# Altium project PRJ_Arduino_uno_r3_THT.PrjPcb
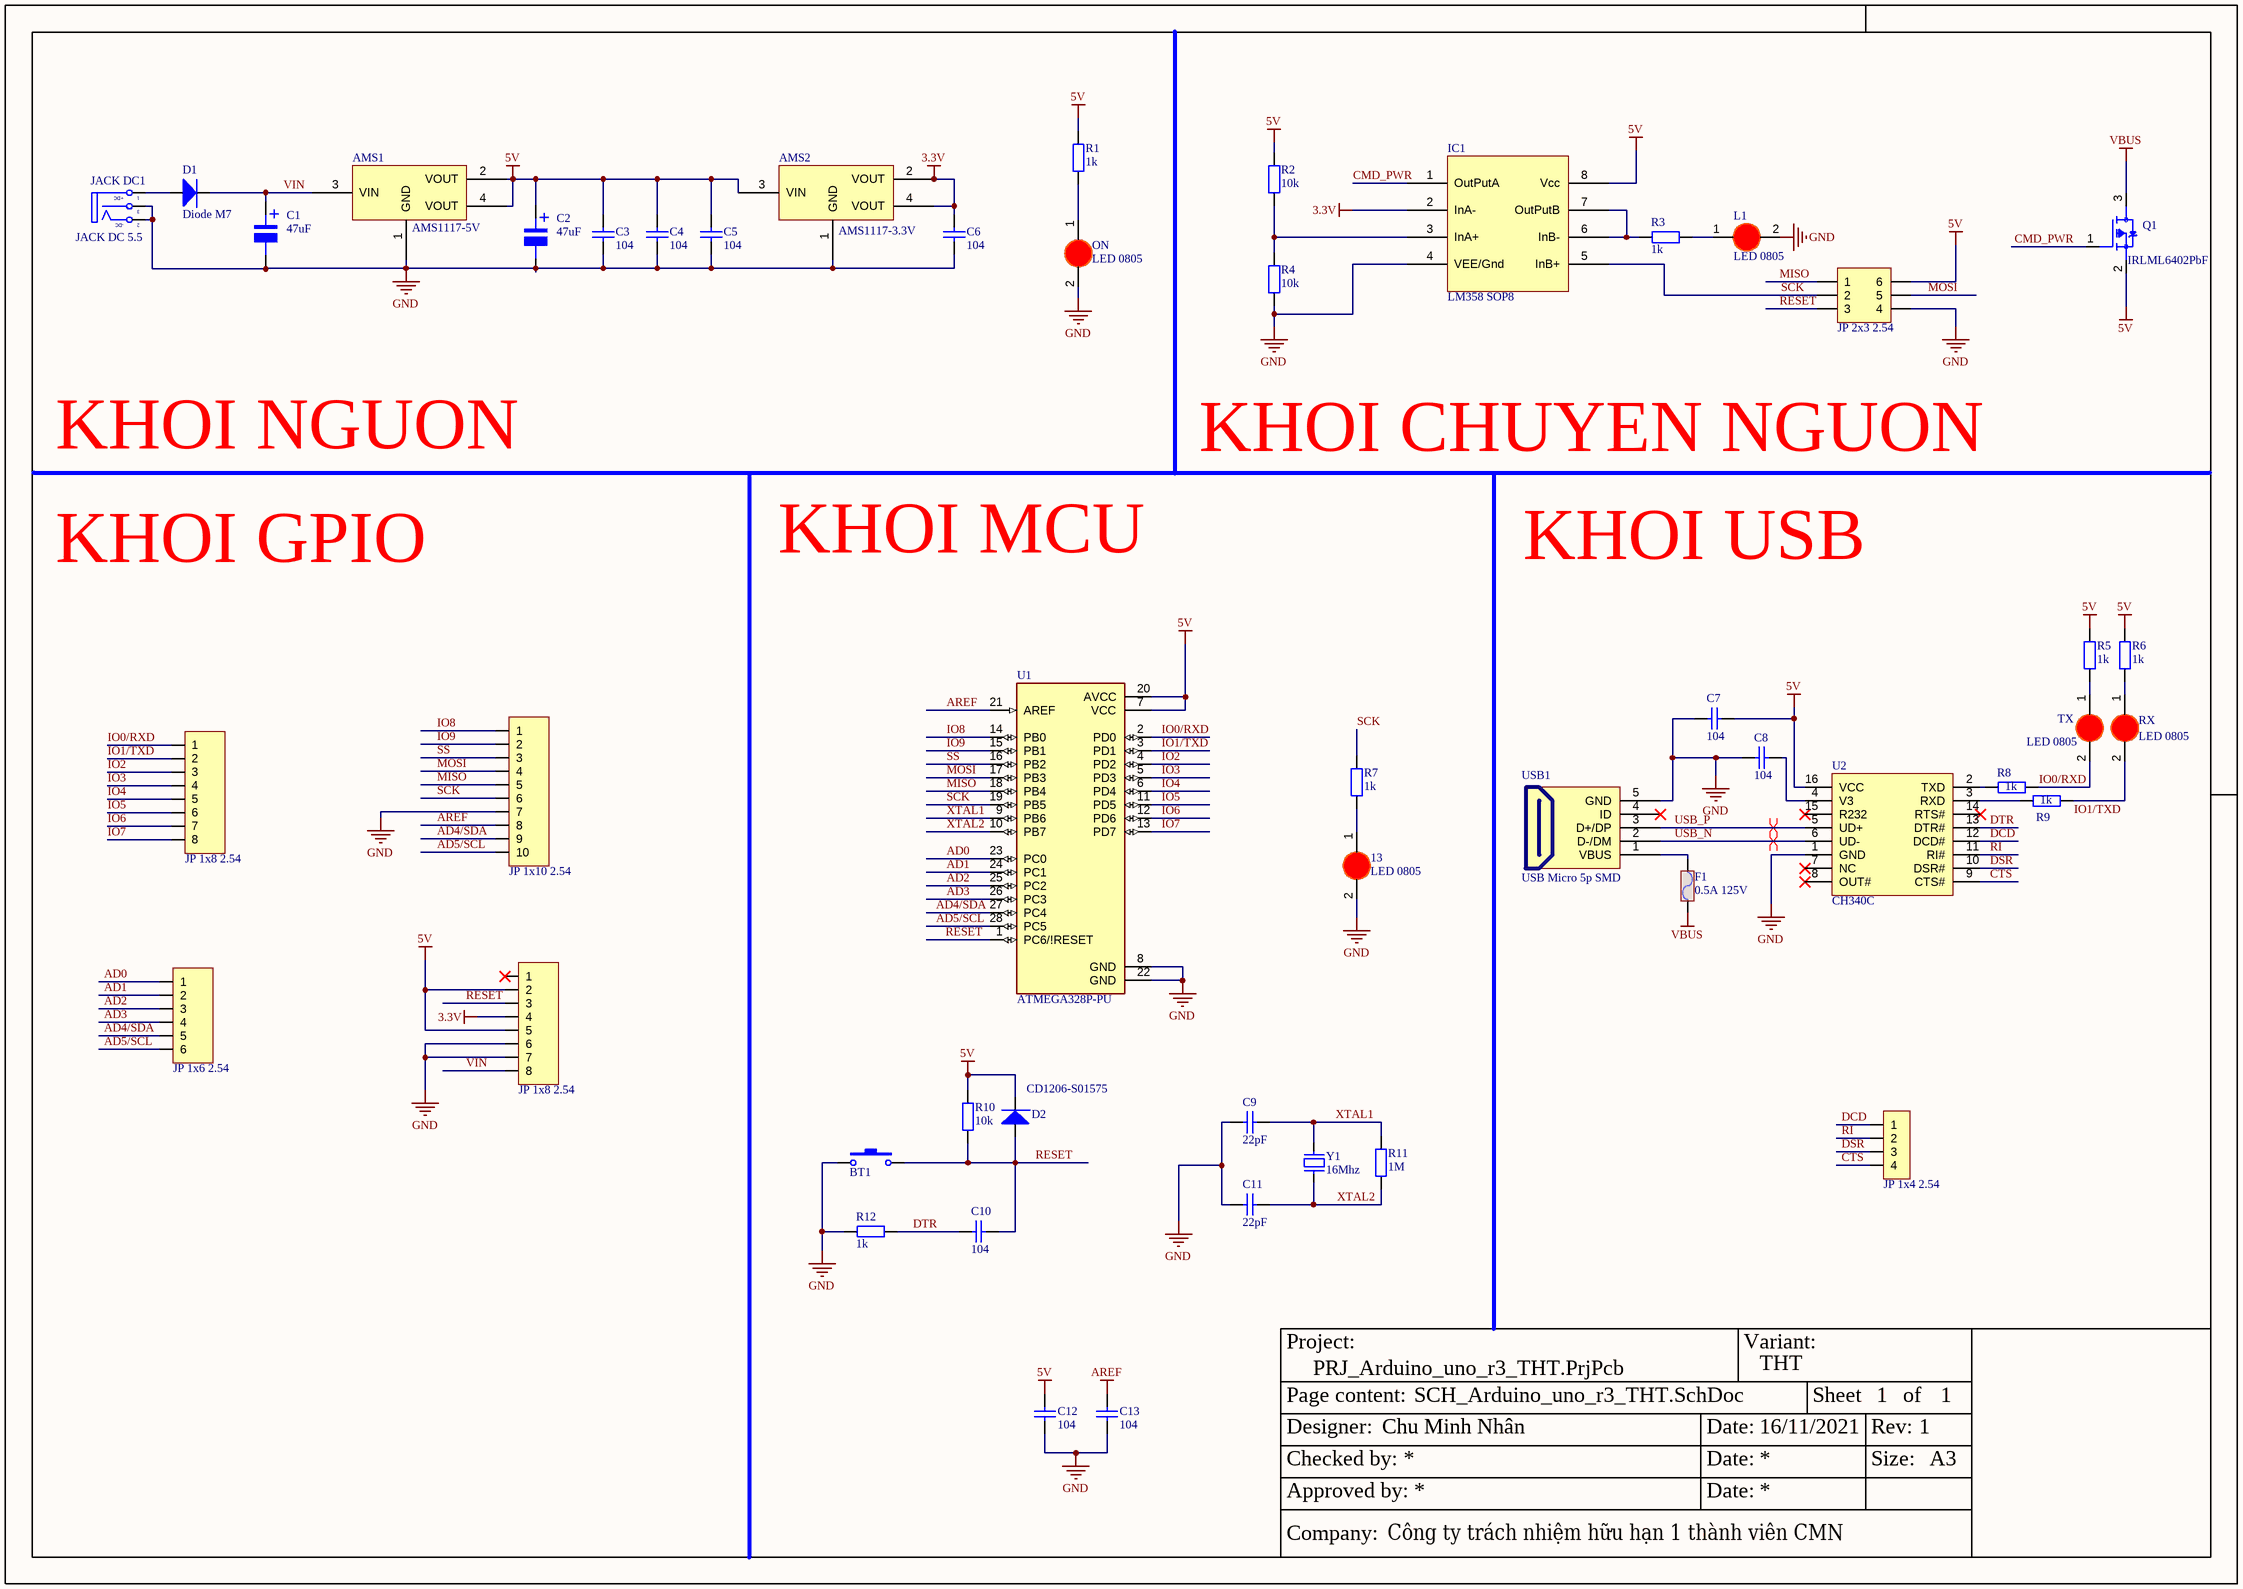
[diagram p0: SCH_Arduino_uno_r3_THT.SchDoc]
1 sheet, 49 parts. Net scope: global (net labels, ports and power ports of the same name join across sheets).
Board file: PCB_Arduino_uno_r3_THT.PcbDoc

## Sheet SCH_Arduino_uno_r3_THT.SchDoc
size 420 x 297 mm; Author: Chu Minh Nhân; CompanyName: Công ty trách nhiệm hữu hạn 1 thành viên CMN; Revision: 1; SheetNumber: 1; SheetTotal: 1; SheetSize: A3; Variant: THT; DateDesigned: 16/11/2021

### Parts
13  LED 0805  [LED-0805-Red]
AMS1  AMS1117-5V  [SOT223]
AMS2  AMS1117-3.3V  [SOT223]
BT1  Nut Nhan 2 Chan SMD 3x6x2.5  [Nut Nhan 2 Chan SMD 3x6x2.5]  (value not drawn)
C1  47uF  [tu nhom 6.3 (d)]
C2  47uF  [tu nhom 6.3 (d)]
C3  104  [tu 0805]
C4  104  [tu 0805]
C5  104  [tu 0805]
C6  104  [tu 0805]
C7  104  [tu 0805]
C8  104  [tu 0805]
C9  22pF  [tu 0805]
C10  104  [tu 0805]
C11  22pF  [tu 0805]
C12  104  [tu 0805]
C13  104  [tu 0805]
D1  Diode M7  [Diode M7]
D2  CD1206-S01575  [CD1206-S01575]
F1  0.5A 125V  [Cau Chi SMD1808]
IC1  LM358 SOP8  [SOP 8]
JACK_DC1  JACK DC 5.5  [JACK DC 5.5]
JP1  JP 2x3 2.54  [JP 2x3 DT - duplicate]
JP2  JP 1x10 2.54  [JP 1x10 CT]
JP3  JP 1x8 2.54  [JP 1x8 CT]
JP4  JP 1x8 2.54  [JP 1x8 CT]
JP5  JP 1x6 2.54  [JP 1x6 CT]
JP6  JP 1x4 2.54  [JP 1x4 DT - duplicate]
L1  LED 0805  [LED-0805-Red]
ON  LED 0805  [LED-0805-Red]
Q1  IRLML6402PbF  [SOT23_1]
R1  1k  [tro smd 0805]
R2  10k  [tro smd 0805]
R3  1k  [tro smd 0805]
R4  10k  [tro smd 0805]
R5  1k  [tro smd 0805]
R6  1k  [tro smd 0805]
R7  1k  [tro smd 0805]
R8  1k  [tro smd 0805]
R9  1k  [tro smd 0805]
R10  10k  [tro smd 0805]
R11  1M  [tro smd 0805]
R12  1k  [tro smd 0805]
RX  LED 0805  [LED-0805-Red]
TX  LED 0805  [LED-0805-Red]
U1  ATMEGA328P-PU  [28 SPDIP]
U2  CH340C  [SOIC16_50_284_25X90_SMT]
USB1  USB Micro 5p SMD  [USB Micro 5p SMD]
Y1  16Mhz  [Thach Anh 2 chan SMD]

### Nets
3.3V: AMS2.2(VOUT) AMS2.4(VOUT) C6.1 IC1.2(InA-) JP4.4
5V: AMS1.2(VOUT) AMS1.4(VOUT) AMS2.3(VIN) C2.1 C3.1 C4.1 C5.1 C7.2 C12.2 D2.Cathode IC1.8(Vcc) JP1.6 JP4.2 JP4.5 Q1.2(S) R1.2 R2.2 R5.1 R6.1 R10.2 U1.7(VCC) U1.20(AVCC) U2.16(VCC)
AREF: C13.2 JP2.8 U1.21(AREF)
GND: 13.2(K) AMS1.1(GND) AMS2.1(GND) BT1.1 C1.2 C2.2 C3.2 C4.2 C5.2 C6.2 C7.1 C8.1 C9.2 C11.2 C12.1 C13.1 IC1.4(VEE/Gnd) JACK_DC1.2(TN) JACK_DC1.3(S) JP1.4 JP2.7 JP4.6 JP4.7 L1.2(K) ON.2(K) R4.1 R12.1 U1.8(GND) U1.22(GND) U2.1(GND) USB1.5(GND)
VBUS: F1.1 Q1.3(D)
AD0: JP5.1 U1.23(PC0)
AD1: JP5.2 U1.24(PC1)
AD2: JP5.3 U1.25(PC2)
AD3: JP5.4 U1.26(PC3)
AD4/SDA: JP2.9 JP5.5 U1.27(PC4)
AD5/SCL: JP2.10 JP5.6 U1.28(PC5)
CMD_PWR: IC1.1(OutPutA) Q1.1(G)
CTS: JP6.4 U2.9(CTS#)
DCD: JP6.1 U2.12(DCD#)
DSR: JP6.3 U2.10(DSR#)
DTR: C10.2 R12.2 U2.13(DTR#)
IO0/RXD: JP3.1 R8.1 TX.2(K) U1.2(PD0)
IO1/TXD: JP3.2 R9.1 RX.2(K) U1.3(PD1)
IO2: JP3.3 U1.4(PD2)
IO3: JP3.4 U1.5(PD3)
IO4: JP3.5 U1.6(PD4)
IO5: JP3.6 U1.11(PD5)
IO6: JP3.7 U1.12(PD6)
IO7: JP3.8 U1.13(PD7)
IO8: JP2.1 U1.14(PB0)
IO9: JP2.2 U1.15(PB1)
MISO: JP1.1 JP2.5 U1.18(PB4)
MOSI: JP1.5 JP2.4 U1.17(PB3)
RESET: BT1.2 C10.1 D2.Anode JP1.3 JP4.3 R10.1 U1.1(PC6/!RESET)
RI: JP6.2 U2.11(RI#)
SCK: IC1.5(InB+) JP1.2 JP2.6 R7.2 U1.19(PB5)
SS: JP2.3 U1.16(PB2)
USB_N: U2.6(UD-) USB1.2(D-/DM)
USB_P: U2.5(UD+) USB1.3(D+/DP)
VIN: AMS1.3(VIN) C1.1 D1.Cathode JP4.8
XTAL1: C9.1 R11.2 U1.9(PB6) Y1.2
XTAL2: C11.1 R11.1 U1.10(PB7) Y1.1
Net13_1: 13.1(A) R7.1
NetC8_2: C8.2 U2.4(V3)
NetD1_Anode: D1.Anode JACK_DC1.1(T)
NetF1_2: F1.2 USB1.1(VBUS)
NetIC1_3: IC1.3(InA+) R2.1 R4.2
NetIC1_6: IC1.6(InB-) IC1.7(OutPutB) R3.2
NetL1_1: L1.1(A) R3.1
NetON_1: ON.1(A) R1.1
NetR5_2: R5.2 TX.1(A)
NetR6_2: R6.2 RX.1(A)
NetR8_2: R8.2 U2.2(TXD)
NetR9_2: R9.2 U2.3(RXD)

Not connected (* = marked no-connect by the designer): JP4 1*; U2 7(NC)* 8(OUT#)* 14(RTS#)* 15(R232)*; USB1 4(ID)*

### Layout directives
differential pair: USB_N, USB_P

### Notes on the sheet
- KHOI NGUON
- KHOI CHUYEN NGUON
- KHOI GPIO
- KHOI MCU
- KHOI USB
- Project:
- Page content:
- Variant:
- Sheet
- of
- Designer:
- Checked by:
- Date:
- Rev:
- Size:
- Approved by:
- Company:
- (in symbol JACK DC 5.5) +DC; -DC
- (in symbol Tu Nhom 47uF 50V) +

### Library data of the parts
13 L1 ON RX TX = LED 0805 Do: Dán; Don_Vi: Con; Ma_Hang: MH000897; Ten_Linh_Kien: LED 0805 Màu Đỏ (Red); Ghi_Chu: *; Kieu_Chan: *; Chung_Loai: Dán
AMS1 = AMS1117_5V SMD: Dán; Don_Vi: Con; Ma_Hang: MH000596; Value: AMS1117-3.3V SOT223; Ghi_Chu: *; Kieu_Chan: *; Chung_Loai: Dán
AMS2 = AMS1117_3V3 SMD: Dán; Value: AMS1117-3.3V SOT223; Don_Vi: Con; Ma_Hang: MH000596; Ghi_Chu: *; Kieu_Chan: *; Chung_Loai: Dán
BT1 = Nut Nhan 2 Chan SMD 3x6x2.5: Ma_Hang: MH001036; Ten: Nút Nhấn 2 Chân 3x6x2.5MM SMD
C1 C2 = Tu Nhom 47uF 50V: Dán; Don_Vi: Con; So_Chan: 2; Ten_Linh_Kien: Tụ Nhôm 47uF 50V 6.3x5.5MM; Ma_Hang: MH002217; Chung_Loai: Dán; Kieu_Chan: *
C3-C8 C10 C12 C13 = Tu 0805 104 50V 10%: Dán; Don_Vi: Con; So_Chan: 2; Ten_Linh_Kien: Tụ 0805 104-100nF 10% 50V; Ma_Hang: MH004551; Chung_Loai: Dán; Kieu_Chan: *
C9 C11 = Tu 0805 22pF 50V 10%: Dán; Don_Vi: Con; So_Chan: 2; Ten_Linh_Kien: Tụ 0805 22P 10% 50V; Ma_Hang: MH004560; Chung_Loai: Dán; Kieu_Chan: *
D1 = Diode M7: Diode Standard 100V 150mA Surface Mount 1206 (1N4007); MP: CD1206-S01575; MF: Bourns; Price: None; Availability: Unavailable; Package: 1206 Bourns; Value: *; SnapEDA_Link: https://www.snapeda.com/parts/CD1206-S01575/Bourns%20-%20J.W.%20Miller/view-part/42622/?ref=snap; Parameter 1: *
D2 = CD1206-S01575: Diode Standard 100V 150mA Surface Mount 1206; MF: Bourns; Price: None; Availability: Unavailable; Package: 1206 Bourns; MP: CD1206-S01575; Value: *; SnapEDA_Link: https://www.snapeda.com/parts/CD1206-S01575/Bourns%20-%20J.W.%20Miller/view-part/42622/?ref=snap
F1 = Cau chi 0.5A 125V SMD1808: Ma_Hang: MH009241; Ten: Cầu Chì 0.5A 125V SMD1808 0451.500MRL
IC1 = LM358 SOP8: Dán; Ma_Hang: MH000609; Don_Vi: Con; Ten_Linh_Kien: LM358 SOP8; Kieu_Chan: *; Ghi_Chu: *; Chung_Loai: Dán
JACK_DC1 = JACK DC 5.5: Value: Jac DC
JP1 = JP 2x3 2.54 Duc Thang: Cắm; Ten_Linh_Kien: Jump Đôi Đực 2.54MM 2x40P Thẳng 11MM; Don_Vi: Con; Ma_Hang: MH002686; Ghi_Chu: *; Kieu_Chan: *; Chung_Loai: Cắm
JP2 = JP 1x10 2.54 Cai Thang: Cắm; Ten_Linh_Kien: Jump Đơn Cái 2.54MM 1x20P Thẳng; Don_Vi: Con; Ma_Hang: MH004006; Ghi_Chu: *; Kieu_Chan: *; Chung_Loai: Cắm
JP3 JP4 = JP 1x8 2.54 Cai Thang: Cắm; Ten_Linh_Kien: Jump Đơn Cái 2.54MM 1x20P Thẳng; Don_Vi: Con; Ma_Hang: MH004006; Ghi_Chu: *; Kieu_Chan: *; Chung_Loai: Cắm
JP5 = JP 1x6 2.54 Cai Thang: Cắm; Ten_Linh_Kien: Jump Đơn Cái 2.54MM 1x20P Thẳng; Don_Vi: Con; Ma_Hang: MH004006; Ghi_Chu: *; Kieu_Chan: *; Chung_Loai: Cắm
JP6 = JP 1x4 2.54 Duc Thang: Cắm; Ten_Linh_Kien: Jump Đơn Đực 2.54MM 1x40P Thẳng 11MM; Don_Vi: Con; Ma_Hang: MH000903; Ghi_Chu: *; Kieu_Chan: *; Chung_Loai: Cắm
Q1 = IRLML6402PbF: MOSFET P-Channel 20V 3.7A SOT-23
R1 R3 R5-R9 R12 = Tro 0805 5% 1k: Dán; Don_Vi: Con; So_Chan: 2; Ten_Linh_Kien: Trở 0805 5% 1k; Ma_Hang: MH005234; Chung_Loai: Dán; Kieu_Chan: *
R2 R4 R10 = Tro 0805 5% 10k: Dán; Don_Vi: Con; So_Chan: 2; Ten_Linh_Kien: Trở 0805 5% 10k; Ma_Hang: MH005239; Chung_Loai: Dán; Kieu_Chan: *
R11 = Tro 0805 5% 1M: Dán; Don_Vi: Con; So_Chan: 2; Ten_Linh_Kien: Trở 0805 5% 1M; Ma_Hang: MH005235; Chung_Loai: Dán; Kieu_Chan: *
U1 = ATMEGA328P-PU: AVR AVRÂ® ATmega Microcontroller IC 8-Bit 20MHz 32KB _16K x 16_ FLASH 28-PDIP; MF: Microchip; Package: PDIP-28 Atmel; Value: *; Availability: Unavailable; SnapEDA_Link: https://www.snapeda.com/parts/ATMEGA328P-PU/Microchip/view-part/44282/?ref=snap; Price: None; MP: ATMEGA328P-PU
U2 = CH340C: USB Bridge, USB to UART USB 2.0 UART Interface; Manufacturer: Olimex; Alternate Part Number-1: NA; Manufacturer Part Number: CH340C; Case/Package: SOIC16; Supplier-1: LCSC; Supplier Part Number-1: C84681
USB1 = USB Micro 5p SMD: USB Type B; Ten: MicroUSB MK5P SMD; Ma_Hang: MH001020
Y1 = Thach Anh 2 chan SMD: Crystal For all Crystal 2pin.; Value: 4Mhz